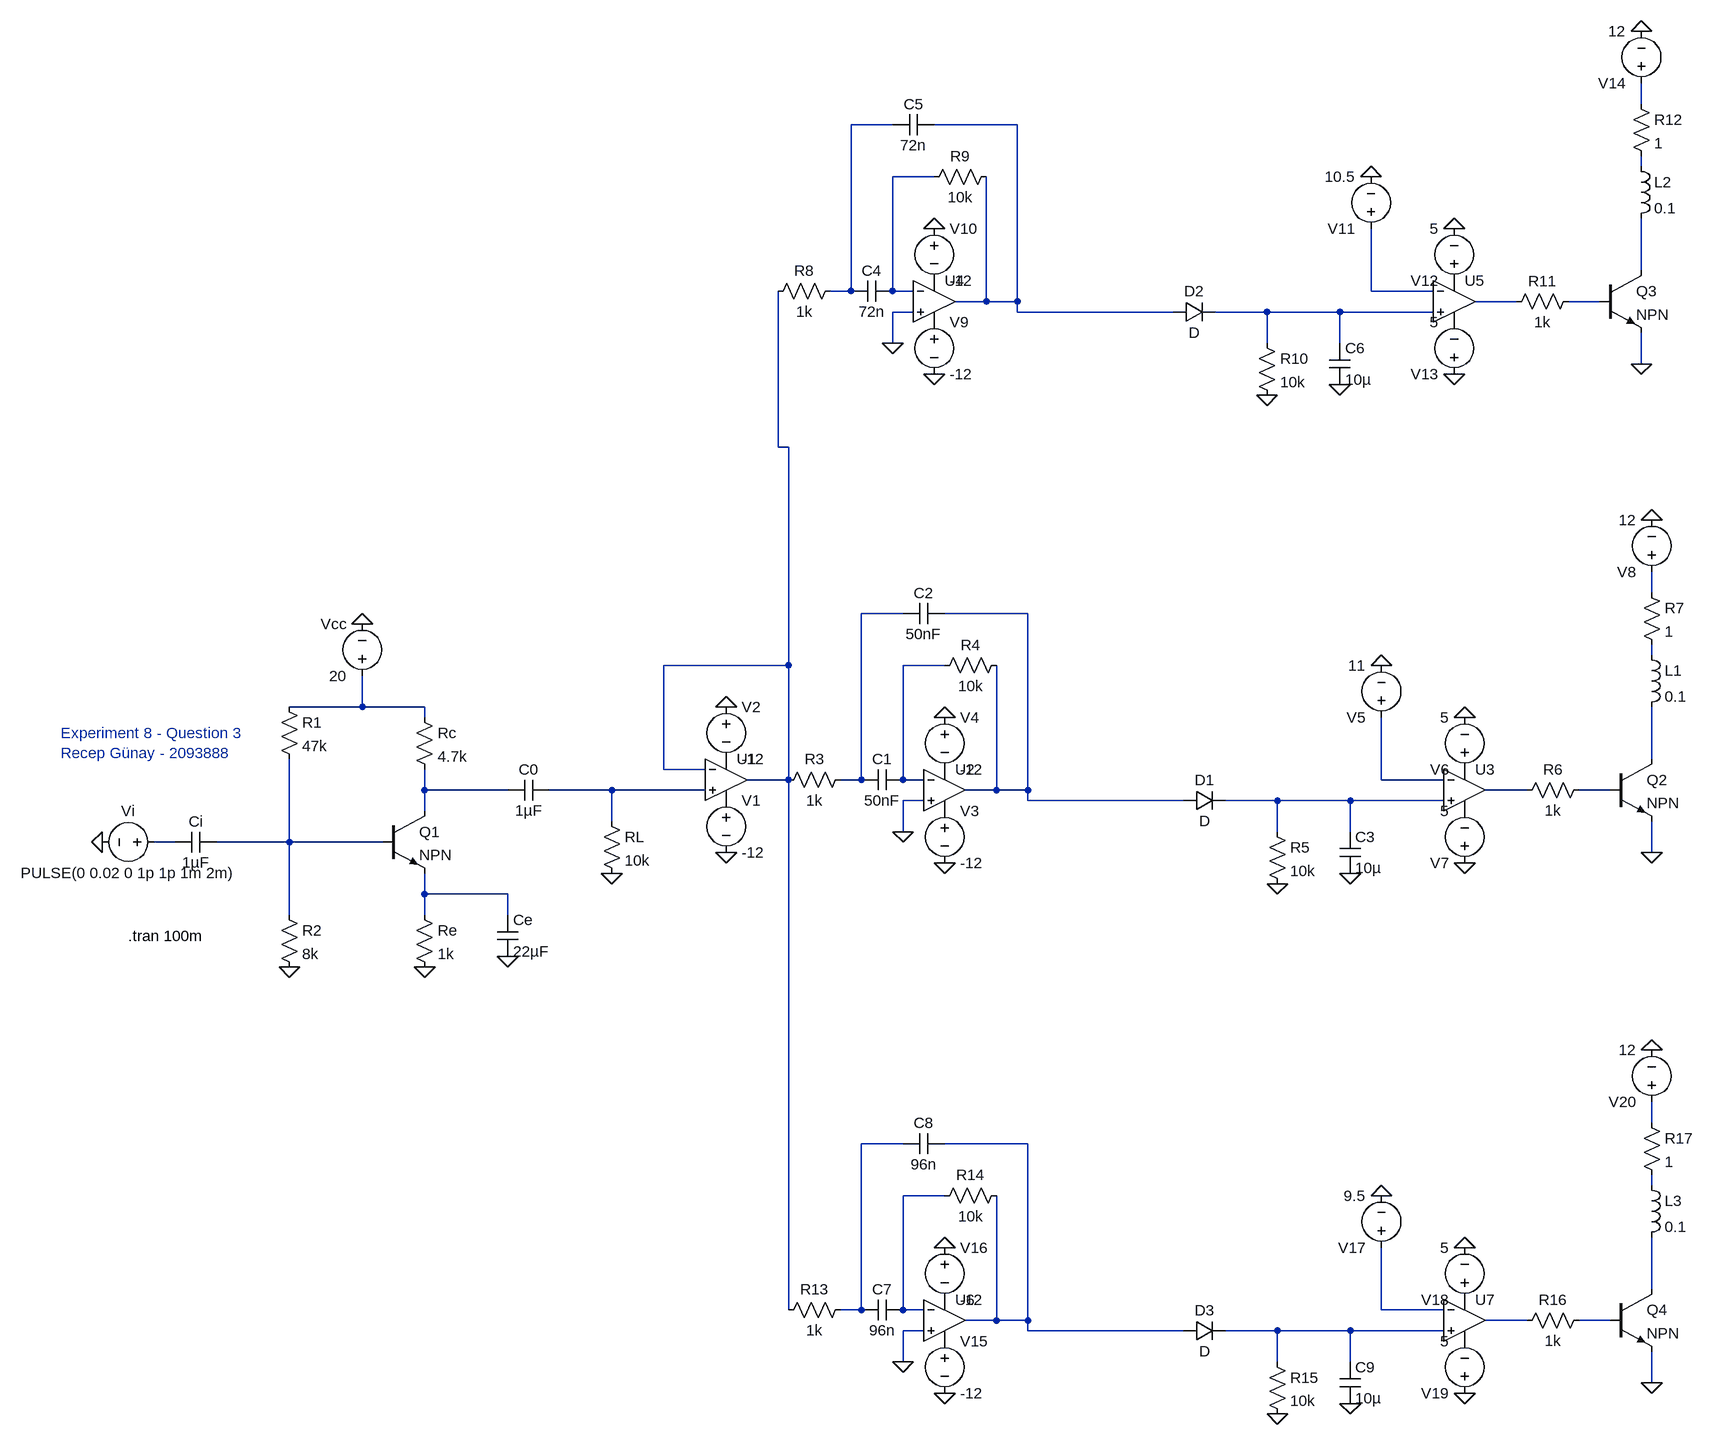
[diagram p0: schematic Second-attempt.asc]
Second-attempt.asc, the LTspice schematic file:
Version 4
SHEET 1 2120 1076
WIRE 2032 -960 2032 -992
WIRE 880 -928 816 -928
WIRE 1072 -928 944 -928
WIRE 2032 -864 2032 -880
WIRE 944 -848 880 -848
WIRE 2032 -704 2032 -784
WIRE 816 -672 816 -928
WIRE 816 -672 784 -672
WIRE 880 -672 880 -848
WIRE 912 -672 880 -672
WIRE 1616 -672 1616 -768
WIRE 1712 -672 1616 -672
WIRE 1024 -656 1024 -848
WIRE 1024 -656 976 -656
WIRE 1072 -656 1072 -928
WIRE 1072 -656 1024 -656
WIRE 1840 -656 1776 -656
WIRE 1968 -656 1920 -656
WIRE 912 -640 880 -640
WIRE 1072 -640 1072 -656
WIRE 1312 -640 1072 -640
WIRE 1456 -640 1376 -640
WIRE 1568 -640 1456 -640
WIRE 1712 -640 1568 -640
WIRE 880 -592 880 -640
WIRE 1456 -592 1456 -640
WIRE 1568 -592 1568 -640
WIRE 2032 -560 2032 -608
WIRE 704 -432 704 -672
WIRE 720 -432 704 -432
WIRE 2048 -208 2048 -240
WIRE 896 -176 832 -176
WIRE 1088 -176 960 -176
WIRE 2048 -112 2048 -128
WIRE 720 -96 720 -432
WIRE 720 -96 528 -96
WIRE 960 -96 896 -96
WIRE 64 -32 64 -80
WIRE 64 -32 -48 -32
WIRE 160 -32 64 -32
WIRE 160 -16 160 -32
WIRE 2048 48 2048 -32
WIRE 528 64 528 -96
WIRE 592 64 528 64
WIRE 720 80 720 -96
WIRE 720 80 656 80
WIRE 832 80 832 -176
WIRE 832 80 800 80
WIRE 896 80 896 -96
WIRE 928 80 896 80
WIRE 1632 80 1632 -16
WIRE 1728 80 1632 80
WIRE 160 96 160 64
WIRE 288 96 160 96
WIRE 448 96 352 96
WIRE 592 96 448 96
WIRE 1040 96 1040 -96
WIRE 1040 96 992 96
WIRE 1088 96 1088 -176
WIRE 1088 96 1040 96
WIRE 1856 96 1792 96
WIRE 1984 96 1936 96
WIRE 928 112 896 112
WIRE 1088 112 1088 96
WIRE 1328 112 1088 112
WIRE 1472 112 1392 112
WIRE 1584 112 1472 112
WIRE 1728 112 1584 112
WIRE 160 128 160 96
WIRE 448 144 448 96
WIRE 896 160 896 112
WIRE 1472 160 1472 112
WIRE 1584 160 1584 112
WIRE -224 176 -256 176
WIRE -48 176 -48 48
WIRE -48 176 -160 176
WIRE 96 176 -48 176
WIRE 2048 192 2048 144
WIRE 160 256 160 224
WIRE 288 256 160 256
WIRE -48 288 -48 176
WIRE 160 288 160 256
WIRE 288 288 288 256
WIRE 2048 608 2048 576
WIRE 896 640 832 640
WIRE 1088 640 960 640
WIRE 2048 704 2048 688
WIRE 960 720 896 720
WIRE 2048 864 2048 784
WIRE 720 896 720 80
WIRE 832 896 832 640
WIRE 832 896 800 896
WIRE 896 896 896 720
WIRE 928 896 896 896
WIRE 1632 896 1632 800
WIRE 1728 896 1632 896
WIRE 1040 912 1040 720
WIRE 1040 912 992 912
WIRE 1088 912 1088 640
WIRE 1088 912 1040 912
WIRE 1856 912 1792 912
WIRE 1984 912 1936 912
WIRE 928 928 896 928
WIRE 1088 928 1088 912
WIRE 1328 928 1088 928
WIRE 1472 928 1392 928
WIRE 1584 928 1472 928
WIRE 1728 928 1584 928
WIRE 896 976 896 928
WIRE 1472 976 1472 928
WIRE 1584 976 1584 928
WIRE 2048 1008 2048 960
FLAG 64 -160 0
FLAG -336 176 0
FLAG -48 368 0
FLAG 160 368 0
FLAG 448 224 0
FLAG 288 352 0
FLAG 896 160 0
FLAG 624 -32 0
FLAG 624 192 0
FLAG 960 208 0
FLAG 960 -16 0
FLAG 1472 240 0
FLAG 1584 224 0
FLAG 1632 -96 0
FLAG 1760 208 0
FLAG 1760 -16 0
FLAG 2048 192 0
FLAG 2048 -320 0
FLAG 880 -592 0
FLAG 944 -544 0
FLAG 944 -768 0
FLAG 1456 -512 0
FLAG 1568 -528 0
FLAG 1616 -848 0
FLAG 1744 -544 0
FLAG 1744 -768 0
FLAG 2032 -560 0
FLAG 2032 -1072 0
FLAG 896 976 0
FLAG 960 1024 0
FLAG 960 800 0
FLAG 1472 1056 0
FLAG 1584 1040 0
FLAG 1632 720 0
FLAG 1760 1024 0
FLAG 1760 800 0
FLAG 2048 1008 0
FLAG 2048 496 0
SYMBOL npn 96 128 R0
SYMATTR InstName Q1
SYMBOL res 144 -32 R0
SYMATTR InstName Rc
SYMATTR Value 4.7k
SYMBOL res -64 -48 R0
SYMATTR InstName R1
SYMATTR Value 47k
SYMBOL res -64 272 R0
SYMATTR InstName R2
SYMATTR Value 8k
SYMBOL res 144 272 R0
SYMATTR InstName Re
SYMATTR Value 1k
SYMBOL cap -160 160 R90
WINDOW 0 0 32 VBottom 2
WINDOW 3 32 32 VTop 2
SYMATTR InstName Ci
SYMATTR Value 1µF
SYMBOL cap 352 80 R90
WINDOW 0 0 32 VBottom 2
WINDOW 3 32 32 VTop 2
SYMATTR InstName C0
SYMATTR Value 1µF
SYMBOL res 432 128 R0
SYMATTR InstName RL
SYMATTR Value 10k
SYMBOL voltage 64 -64 R180
WINDOW 0 24 96 Left 2
WINDOW 3 24 16 Left 2
WINDOW 123 0 0 Left 2
WINDOW 39 0 0 Left 2
SYMATTR InstName Vcc
SYMATTR Value 20
SYMBOL voltage -240 176 R90
WINDOW 0 -32 56 VBottom 2
WINDOW 3 32 56 VTop 2
WINDOW 123 0 0 Left 2
WINDOW 39 0 0 Left 2
SYMATTR InstName Vi
SYMATTR Value PULSE(0 0.02 0 1p 1p 1m 2m)
SYMBOL cap 272 288 R0
SYMATTR InstName Ce
SYMATTR Value 22µF
SYMBOL Opamps\\UniversalOpamp2 624 80 R0
SYMATTR InstName U1
SYMBOL Opamps\\UniversalOpamp2 960 96 R0
SYMATTR InstName U2
SYMBOL res 816 64 R90
WINDOW 0 0 56 VBottom 2
WINDOW 3 32 56 VTop 2
SYMATTR InstName R3
SYMATTR Value 1k
SYMBOL cap 896 64 R90
WINDOW 0 0 32 VBottom 2
WINDOW 3 32 32 VTop 2
SYMATTR InstName C1
SYMATTR Value 50nF
SYMBOL cap 960 -192 R90
WINDOW 0 0 32 VBottom 2
WINDOW 3 32 32 VTop 2
SYMATTR InstName C2
SYMATTR Value 50nF
SYMBOL res 1056 -112 R90
WINDOW 0 0 56 VBottom 2
WINDOW 3 32 56 VTop 2
SYMATTR InstName R4
SYMATTR Value 10k
SYMBOL voltage 624 96 R0
WINDOW 123 0 0 Left 2
WINDOW 39 0 0 Left 2
SYMATTR InstName V1
SYMATTR Value -12
SYMBOL voltage 624 -48 R0
WINDOW 123 0 0 Left 2
WINDOW 39 0 0 Left 2
SYMATTR InstName V2
SYMATTR Value -12
SYMBOL voltage 960 112 R0
WINDOW 123 0 0 Left 2
WINDOW 39 0 0 Left 2
SYMATTR InstName V3
SYMATTR Value -12
SYMBOL voltage 960 -32 R0
WINDOW 123 0 0 Left 2
WINDOW 39 0 0 Left 2
SYMATTR InstName V4
SYMATTR Value -12
SYMBOL diode 1328 128 R270
WINDOW 0 32 32 VTop 2
WINDOW 3 0 32 VBottom 2
SYMATTR InstName D1
SYMBOL res 1456 144 R0
SYMATTR InstName R5
SYMATTR Value 10k
SYMBOL cap 1568 160 R0
SYMATTR InstName C3
SYMATTR Value 10µ
SYMBOL Opamps\\UniversalOpamp2 1760 96 R0
SYMATTR InstName U3
SYMBOL voltage 1632 0 R180
WINDOW 123 0 0 Left 2
WINDOW 39 0 0 Left 2
SYMATTR InstName V5
SYMATTR Value 11
SYMBOL voltage 1760 80 R180
WINDOW 123 0 0 Left 2
WINDOW 39 0 0 Left 2
SYMATTR InstName V6
SYMATTR Value 5
SYMBOL voltage 1760 224 R180
WINDOW 123 0 0 Left 2
WINDOW 39 0 0 Left 2
SYMATTR InstName V7
SYMATTR Value 5
SYMBOL res 1952 80 R90
WINDOW 0 0 56 VBottom 2
WINDOW 3 32 56 VTop 2
SYMATTR InstName R6
SYMATTR Value 1k
SYMBOL npn 1984 48 R0
SYMATTR InstName Q2
SYMBOL ind 2032 -128 R0
SYMATTR InstName L1
SYMATTR Value 0.1
SYMBOL voltage 2048 -224 R180
WINDOW 123 0 0 Left 2
WINDOW 39 0 0 Left 2
SYMATTR InstName V8
SYMATTR Value 12
SYMBOL res 2032 -224 R0
SYMATTR InstName R7
SYMATTR Value 1
SYMBOL Opamps\\UniversalOpamp2 944 -656 R0
SYMATTR InstName U4
SYMBOL res 800 -688 R90
WINDOW 0 0 56 VBottom 2
WINDOW 3 32 56 VTop 2
SYMATTR InstName R8
SYMATTR Value 1k
SYMBOL cap 880 -688 R90
WINDOW 0 0 32 VBottom 2
WINDOW 3 32 32 VTop 2
SYMATTR InstName C4
SYMATTR Value 72n
SYMBOL cap 944 -944 R90
WINDOW 0 0 32 VBottom 2
WINDOW 3 32 32 VTop 2
SYMATTR InstName C5
SYMATTR Value 72n
SYMBOL res 1040 -864 R90
WINDOW 0 0 56 VBottom 2
WINDOW 3 32 56 VTop 2
SYMATTR InstName R9
SYMATTR Value 10k
SYMBOL voltage 944 -640 R0
WINDOW 123 0 0 Left 2
WINDOW 39 0 0 Left 2
SYMATTR InstName V9
SYMATTR Value -12
SYMBOL voltage 944 -784 R0
WINDOW 123 0 0 Left 2
WINDOW 39 0 0 Left 2
SYMATTR InstName V10
SYMATTR Value -12
SYMBOL diode 1312 -624 R270
WINDOW 0 32 32 VTop 2
WINDOW 3 0 32 VBottom 2
SYMATTR InstName D2
SYMBOL res 1440 -608 R0
SYMATTR InstName R10
SYMATTR Value 10k
SYMBOL cap 1552 -592 R0
SYMATTR InstName C6
SYMATTR Value 10µ
SYMBOL Opamps\\UniversalOpamp2 1744 -656 R0
SYMATTR InstName U5
SYMBOL voltage 1616 -752 R180
WINDOW 123 0 0 Left 2
WINDOW 39 0 0 Left 2
SYMATTR InstName V11
SYMATTR Value 10.5
SYMBOL voltage 1744 -672 R180
WINDOW 123 0 0 Left 2
WINDOW 39 0 0 Left 2
SYMATTR InstName V12
SYMATTR Value 5
SYMBOL voltage 1744 -528 R180
WINDOW 123 0 0 Left 2
WINDOW 39 0 0 Left 2
SYMATTR InstName V13
SYMATTR Value 5
SYMBOL res 1936 -672 R90
WINDOW 0 0 56 VBottom 2
WINDOW 3 32 56 VTop 2
SYMATTR InstName R11
SYMATTR Value 1k
SYMBOL npn 1968 -704 R0
SYMATTR InstName Q3
SYMBOL ind 2016 -880 R0
SYMATTR InstName L2
SYMATTR Value 0.1
SYMBOL voltage 2032 -976 R180
WINDOW 123 0 0 Left 2
WINDOW 39 0 0 Left 2
SYMATTR InstName V14
SYMATTR Value 12
SYMBOL res 2016 -976 R0
SYMATTR InstName R12
SYMATTR Value 1
SYMBOL Opamps\\UniversalOpamp2 960 912 R0
SYMATTR InstName U6
SYMBOL res 816 880 R90
WINDOW 0 0 56 VBottom 2
WINDOW 3 32 56 VTop 2
SYMATTR InstName R13
SYMATTR Value 1k
SYMBOL cap 896 880 R90
WINDOW 0 0 32 VBottom 2
WINDOW 3 32 32 VTop 2
SYMATTR InstName C7
SYMATTR Value 96n
SYMBOL cap 960 624 R90
WINDOW 0 0 32 VBottom 2
WINDOW 3 32 32 VTop 2
SYMATTR InstName C8
SYMATTR Value 96n
SYMBOL res 1056 704 R90
WINDOW 0 0 56 VBottom 2
WINDOW 3 32 56 VTop 2
SYMATTR InstName R14
SYMATTR Value 10k
SYMBOL voltage 960 928 R0
WINDOW 123 0 0 Left 2
WINDOW 39 0 0 Left 2
SYMATTR InstName V15
SYMATTR Value -12
SYMBOL voltage 960 784 R0
WINDOW 123 0 0 Left 2
WINDOW 39 0 0 Left 2
SYMATTR InstName V16
SYMATTR Value -12
SYMBOL diode 1328 944 R270
WINDOW 0 32 32 VTop 2
WINDOW 3 0 32 VBottom 2
SYMATTR InstName D3
SYMBOL res 1456 960 R0
SYMATTR InstName R15
SYMATTR Value 10k
SYMBOL cap 1568 976 R0
SYMATTR InstName C9
SYMATTR Value 10µ
SYMBOL Opamps\\UniversalOpamp2 1760 912 R0
SYMATTR InstName U7
SYMBOL voltage 1632 816 R180
WINDOW 123 0 0 Left 2
WINDOW 39 0 0 Left 2
SYMATTR InstName V17
SYMATTR Value 9.5
SYMBOL voltage 1760 896 R180
WINDOW 123 0 0 Left 2
WINDOW 39 0 0 Left 2
SYMATTR InstName V18
SYMATTR Value 5
SYMBOL voltage 1760 1040 R180
WINDOW 123 0 0 Left 2
WINDOW 39 0 0 Left 2
SYMATTR InstName V19
SYMATTR Value 5
SYMBOL res 1952 896 R90
WINDOW 0 0 56 VBottom 2
WINDOW 3 32 56 VTop 2
SYMATTR InstName R16
SYMATTR Value 1k
SYMBOL npn 1984 864 R0
SYMATTR InstName Q4
SYMBOL ind 2032 688 R0
SYMATTR InstName L3
SYMATTR Value 0.1
SYMBOL voltage 2048 592 R180
WINDOW 123 0 0 Left 2
WINDOW 39 0 0 Left 2
SYMATTR InstName V20
SYMATTR Value 12
SYMBOL res 2032 592 R0
SYMATTR InstName R17
SYMATTR Value 1
TEXT -296 320 Left 2 !.tran 100m
TEXT -400 8 Left 2 ;Experiment 8 - Question 3\nRecep Günay - 2093888

The netlist it stands for:
* Second-attempt.asc
Q1 N020 N026 N027 0 NPN
Rc N017 N020 4.7k
R1 N017 N026 47k
R2 N026 0 8k
Re N027 0 1k
Ci N026 N025 1µF
C0 N021 N020 1µF
RL N021 0 10k
Vcc N017 0 20
Vi N025 0 PULSE(0 0.02 0 1p 1p 1m 2m)
Ce N027 0 22µF
XU1 N021 N011 P001 P002 N011 level.2 Avol=1Meg GBW=10Meg Slew=10Meg ilimit=25m rail=0 Vos=0 phimargin=45 en=0 enk=0 in=0 ink=0 Rin=500Meg  ; pins IN+ IN- V+ V- OUT
XU2 0 N016 P003 P004 N014 level.2 Avol=1Meg GBW=10Meg Slew=10Meg ilimit=25m rail=0 Vos=0 phimargin=45 en=0 enk=0 in=0 ink=0 Rin=500Meg  ; pins IN+ IN- V+ V- OUT
R3 N013 N011 1k
C1 N016 N013 50nF
C2 N014 N013 50nF
R4 N014 N016 10k
V1 P002 0 -12
V2 0 P001 -12
V3 P004 0 -12
V4 0 P003 -12
D1 N014 N024 D
R5 N024 0 10k
C3 N024 0 10µ
XU3 N024 N019 P005 P006 N022 level.2 Avol=1Meg GBW=10Meg Slew=10Meg ilimit=25m rail=0 Vos=0 phimargin=45 en=0 enk=0 in=0 ink=0 Rin=500Meg  ; pins IN+ IN- V+ V- OUT
V5 N019 0 11
V6 P005 0 5
V7 0 P006 5
R6 N023 N022 1k
Q2 N018 N023 0 0 NPN
L1 N015 N018 0.1
V8 N012 0 12
R7 N012 N015 1
XU4 0 N005 P007 P008 N003 level.2 Avol=1Meg GBW=10Meg Slew=10Meg ilimit=25m rail=0 Vos=0 phimargin=45 en=0 enk=0 in=0 ink=0 Rin=500Meg  ; pins IN+ IN- V+ V- OUT
R8 N002 N011 1k
C4 N005 N002 72n
C5 N003 N002 72n
R9 N003 N005 10k
V9 P008 0 -12
V10 0 P007 -12
D2 N003 N010 D
R10 N010 0 10k
C6 N010 0 10µ
XU5 N010 N007 P009 P010 N008 level.2 Avol=1Meg GBW=10Meg Slew=10Meg ilimit=25m rail=0 Vos=0 phimargin=45 en=0 enk=0 in=0 ink=0 Rin=500Meg  ; pins IN+ IN- V+ V- OUT
V11 N007 0 10.5
V12 P009 0 5
V13 0 P010 5
R11 N009 N008 1k
Q3 N006 N009 0 0 NPN
L2 N004 N006 0.1
V14 N001 0 12
R12 N001 N004 1
XU6 0 N032 P011 P012 N030 level.2 Avol=1Meg GBW=10Meg Slew=10Meg ilimit=25m rail=0 Vos=0 phimargin=45 en=0 enk=0 in=0 ink=0 Rin=500Meg  ; pins IN+ IN- V+ V- OUT
R13 N029 N011 1k
C7 N032 N029 96n
C8 N030 N029 96n
R14 N030 N032 10k
V15 P012 0 -12
V16 0 P011 -12
D3 N030 N037 D
R15 N037 0 10k
C9 N037 0 10µ
XU7 N037 N034 P013 P014 N035 level.2 Avol=1Meg GBW=10Meg Slew=10Meg ilimit=25m rail=0 Vos=0 phimargin=45 en=0 enk=0 in=0 ink=0 Rin=500Meg  ; pins IN+ IN- V+ V- OUT
V17 N034 0 9.5
V18 P013 0 5
V19 0 P014 5
R16 N036 N035 1k
Q4 N033 N036 0 0 NPN
L3 N031 N033 0.1
V20 N028 0 12
R17 N028 N031 1
.model D D
.lib standard.dio
.model NPN NPN
.model PNP PNP
.lib standard.bjt
.tran 100m
* Experiment 8 - Question 3
* Recep Günay - 2093888
.lib UniversalOpamps2.sub
.backanno
.end